# EAGLE schematic DC3402 (EAGLE 6.4)
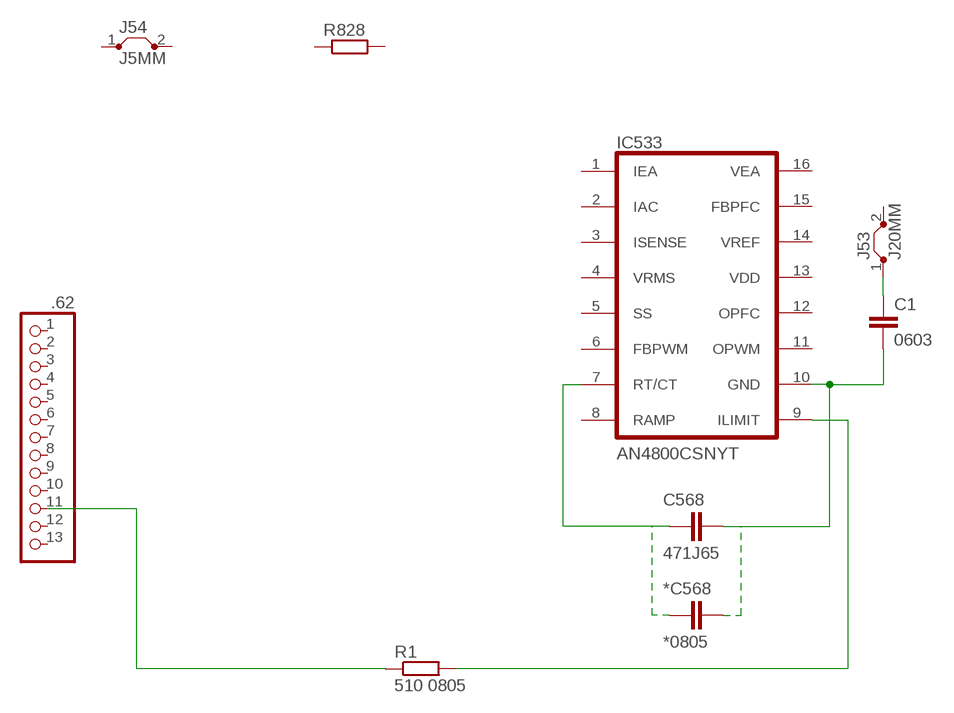
[diagram p0: schematic, sheet 1]

## Parts
*C568  *0805  C-EUC0805  [C0805]
.62  PINHD-1X13/90  [1X13/90]
C1  0603  C-EUC0603  [C0603]
C568  471J65  C-EU025-025X050  [C025-025X050]
IC533  AN4800CSNYT  FAN4800  [DIL16]
J53  J20MM  [20]
J54  J5MM  [05]
R1  510 0805  R-EU_R0805  [R0805]
R828  R-EU_0207/12  [0207/12]

## Nets
N$1: *C568.1 C568.1 IC533.7(RT/CT)
N$2: *C568.2 C1.2 C568.2 IC533.10(GND)
N$3: C1.1 J53.1
N$5: IC533.9(ILIMIT) R1.2
N$6: .62.11 R1.1
Unconnected: .62.1 .62.2 .62.3 .62.4 .62.5 .62.6 .62.7 .62.8 .62.9 .62.10 .62.12 .62.13 IC533.1(IEA) IC533.2(IAC) IC533.3(ISENSE) IC533.4(VRMS) IC533.5(SS) IC533.6(FBPWM) IC533.8(RAMP) IC533.11(OPWM) IC533.12(OPFC) IC533.13(VDD) IC533.14(VREF) IC533.15(FBPFC) IC533.16(VEA) J53.2 J54.1 J54.2 R828.1 R828.2

## Library data of the parts
*C568 C1 C568 = rcl:C-EU: CAPACITOR, European symbol
.62 = pinhead:PINHD-1X13: PIN HEADER
IC533 = FAN4800:FAN4800
J53 J54 = jumper:J: Bridge
R1 R828 = rcl:R-EU_: RESISTOR, European symbol